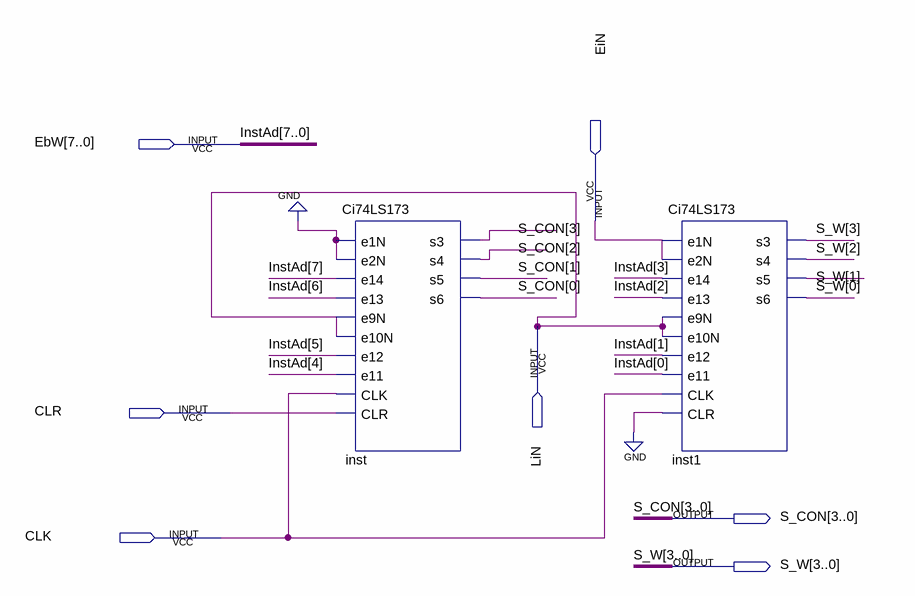
[diagram p0: schematic sheet]
// Quartus schematic Registrador_Instrucoes.bdf as structural Verilog: 2 symbols, 7 pins
module Registrador_Instrucoes (
  input  [7:0] EbW,
  input  EiN,
  input  LiN,
  input  CLR,
  input  CLK,
  output [3:0] S_CON,
  output [3:0] S_W
);

  Ci74LS173 inst (
    .e1N(1'b0), .e2N(1'b0), .e14(EbW[7]), .e13(EbW[6]), .e9N(LiN), .e10N(LiN), .e12(EbW[5]), .e11(EbW[4]),
    .CLK(CLK), .CLR(CLR), .s3(S_CON[3]), .s4(S_CON[2]), .s5(S_CON[1]), .s6(S_CON[0]));
  Ci74LS173 inst1 (
    .e1N(EiN), .e2N(EiN), .e14(EbW[3]), .e13(EbW[2]), .e9N(LiN), .e10N(LiN), .e12(EbW[1]), .e11(EbW[0]),
    .CLK(CLK), .CLR(1'b0), .s3(S_W[3]), .s4(S_W[2]), .s5(S_W[1]), .s6(S_W[0]));

  // Other names for the same wires on the sheet: InstAd[7:0] = EbW
endmodule
